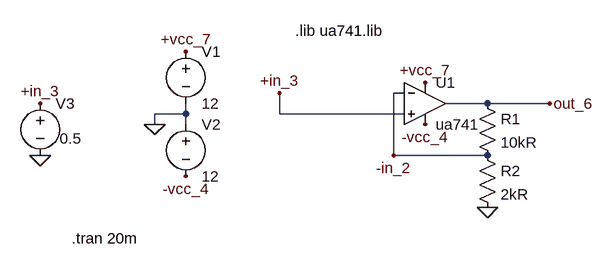
[diagram p0: schematic AmplificadorLi-Fi.asc]
AmplificadorLi-Fi.asc, the LTspice schematic file:
Version 4
SHEET 1 880 680
WIRE 256 128 240 128
WIRE 384 144 320 144
WIRE 480 144 384 144
WIRE -80 160 -80 144
WIRE -80 160 -128 160
WIRE 64 160 64 128
WIRE 256 160 64 160
WIRE -128 176 -128 160
WIRE -80 176 -80 160
WIRE 240 224 240 128
WIRE 384 224 240 224
FLAG -128 176 0
FLAG -80 64 +vcc_7
FLAG -80 256 -vcc_4
FLAG -304 224 0
FLAG 384 304 0
FLAG 480 144 out_6
FLAG -304 144 +in_3
FLAG 64 128 +in_3
FLAG 288 112 +vcc_7
FLAG 288 176 -vcc_4
FLAG 240 224 -in_2
SYMBOL Opamps\\opamp2 288 80 R0
SYMATTR InstName U1
SYMATTR Value ua741
SYMBOL voltage -80 48 R0
WINDOW 123 0 0 Left 2
WINDOW 39 0 0 Left 2
SYMATTR InstName V1
SYMATTR Value 12
SYMBOL voltage -80 160 R0
WINDOW 123 0 0 Left 2
WINDOW 39 0 0 Left 2
SYMATTR InstName V2
SYMATTR Value 12
SYMBOL voltage -304 128 R0
WINDOW 123 0 0 Left 2
WINDOW 39 0 0 Left 2
WINDOW 3 30 70 Left 2
SYMATTR Value 0.5
SYMATTR InstName V3
SYMBOL res 368 128 R0
SYMATTR InstName R1
SYMATTR Value 10kR
SYMBOL res 368 208 R0
SYMATTR InstName R2
SYMATTR Value 2kR
TEXT 88 32 Left 2 !.lib ua741.lib
TEXT -256 352 Left 2 !.tran 20m

The netlist it stands for:
* AmplificadorLi-Fi.asc
XU1 +in_3 -in_2 +vcc_7 -vcc_4 out_6 ua741  ; pins In+ In- V+ V- OUT
V1 +vcc_7 0 12
V2 0 -vcc_4 12
V3 +in_3 0 0.5
R1 out_6 -in_2 10kR
R2 -in_2 0 2kR
.lib ua741.lib
.tran 20m
.backanno
.end